# EAGLE schematic H-Bridge (EAGLE 9.7.0)
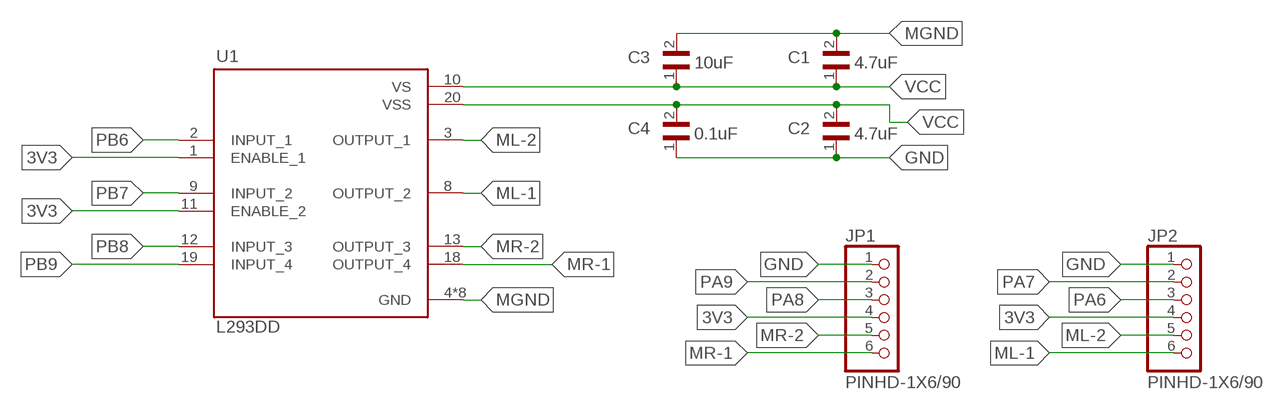
[diagram p0: schematic, sheet 1]

## Parts
C1  4.7uF  GRM0335C1E100JA01D  [CAPC0603X33N]
C2  4.7uF  GRM0335C1E100JA01D  [CAPC0603X33N]
C3  10uF  GRM0335C1E100JA01D  [CAPC0603X33N]
C4  0.1uF  GRM0335C1E100JA01D  [CAPC0603X33N]
JP1  PINHD-1X6/90  [1X06/90]
JP2  PINHD-1X6/90  [1X06/90]
U1  L293DD  [SOIC127P1032X265-20N]

## Nets
3V3: JP1.4 JP2.4 U1.1(ENABLE_1) U1.11(ENABLE_2)
GND: C2.1 C4.1 JP1.1 JP2.1
MGND: C1.2 C3.2 U1.4(GND) U1.5(GND) U1.6(GND) U1.7(GND) U1.14(GND) U1.15(GND) U1.16(GND) U1.17(GND)
ML-1: JP2.6 U1.8(OUTPUT_2)
ML-2: JP2.5 U1.3(OUTPUT_1)
MR-1: JP1.6 U1.18(OUTPUT_4)
MR-2: JP1.5 U1.13(OUTPUT_3)
PA6: JP2.3
PA7: JP2.2
PA8: JP1.3
PA9: JP1.2
PB6: U1.2(INPUT_1)
PB7: U1.9(INPUT_2)
PB8: U1.12(INPUT_3)
PB9: U1.19(INPUT_4)
VCC: C1.1 C2.2 C3.1 C4.2 U1.10(VS) U1.20(VSS)

## Library data of the parts
C1 C2 = Cap4.7uF:GRM0335C1E100JA01D: SMD Capacitor C0G(EIA) with Capacitance: 10pF Tol. 5%. Rated Voltage: 25Vdc
C3 = Cap10uF:GRM0335C1E100JA01D: SMD Capacitor C0G(EIA) with Capacitance: 10pF Tol. 5%. Rated Voltage: 25Vdc
C4 = Cap0.1uF:GRM0335C1E100JA01D: SMD Capacitor C0G(EIA) with Capacitance: 10pF Tol. 5%. Rated Voltage: 25Vdc
JP1 JP2 = Connector:PINHD-1X6: PIN HEADER; CATEGORY: Headers; DESCRIPTION: Header, Right Angle, 6 Position; MANUFACTURER: Generic; MPN: Generic; OPERATING_TEMPERATURE: Generic; PART_STATUS: Active; PITCH: 0.100" (2.54mm); ROHS_COMPLIANCE: Generic; SERIES: Generic; SUB-CATEGORY: Headers, Male Pins; TYPE: Board to Board or Cable, Unshrouded, Through Hole, Right Angle
U1 = L293DD:L293DD: L293DD Series Push - Pull Quad Channel Driver with Diodes - SOIC-20; MANUFACTURER: STMicroelectronics; PARTREV: N/A; STANDARD: IPC-7351B